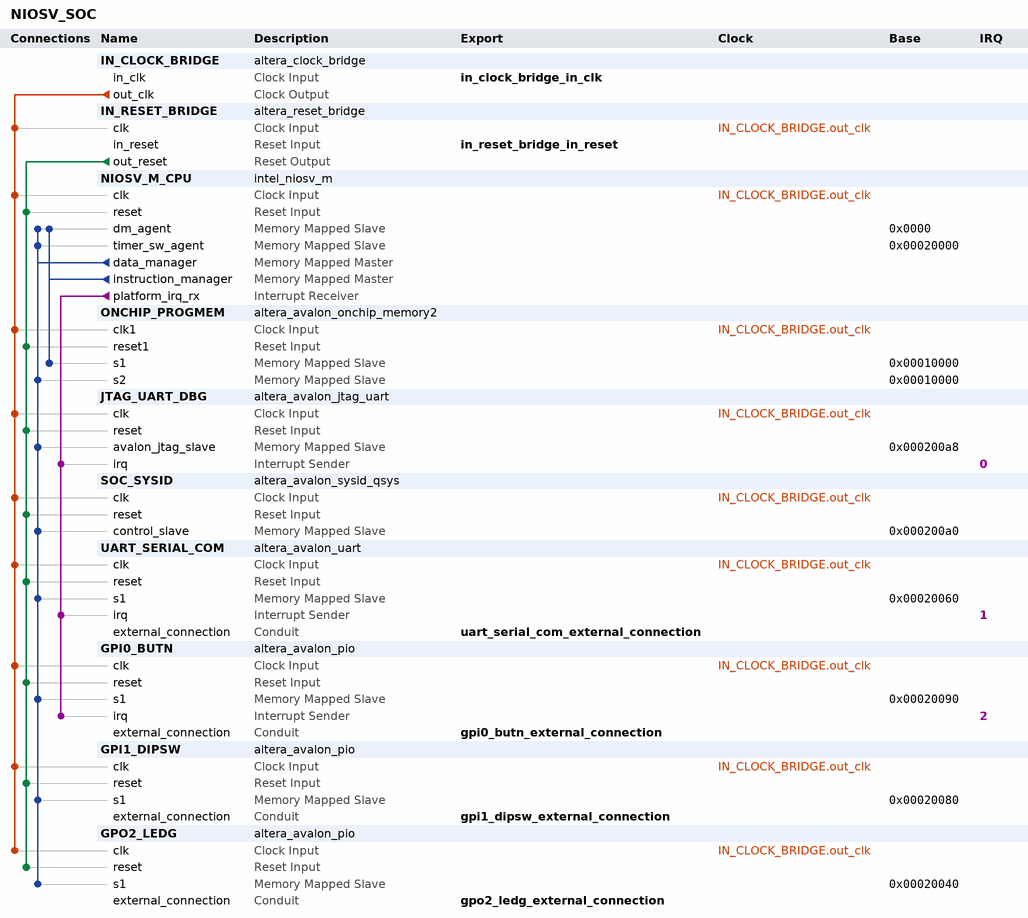
[diagram p0: system contents]
# Platform Designer (Qsys) system NIOSV_SOC, Cyclone IV E EP4CE22F17C6
# Parameters at their usual value, and those the tool derives, are not listed.
package require -exact qsys 23.1
create_system NIOSV_SOC
set_project_property DEVICE_FAMILY {Cyclone IV E}
set_project_property DEVICE EP4CE22F17C6

add_instance IN_CLOCK_BRIDGE altera_clock_bridge 23.1
set_instance_parameter_value IN_CLOCK_BRIDGE DERIVED_CLOCK_RATE 0
set_instance_parameter_value IN_CLOCK_BRIDGE EXPLICIT_CLOCK_RATE 100000000

add_instance IN_RESET_BRIDGE altera_reset_bridge 23.1
set_instance_parameter_value IN_RESET_BRIDGE ACTIVE_LOW_RESET 1
set_instance_parameter_value IN_RESET_BRIDGE SYNCHRONOUS_EDGES deassert

add_instance NIOSV_M_CPU intel_niosv_m 2.0.0
set_instance_parameter_value NIOSV_M_CPU clockFrequency 100000000
set_instance_parameter_value NIOSV_M_CPU enableDebugReset false
set_instance_parameter_value NIOSV_M_CPU enableECCLite true
set_instance_parameter_value NIOSV_M_CPU pipelineArch true
set_instance_parameter_value NIOSV_M_CPU resetSlave ONCHIP_PROGMEM.s1

add_instance ONCHIP_PROGMEM altera_avalon_onchip_memory2 23.1
set_instance_parameter_value ONCHIP_PROGMEM dataWidth 32
set_instance_parameter_value ONCHIP_PROGMEM dualPort true
set_instance_parameter_value ONCHIP_PROGMEM initMemContent true
set_instance_parameter_value ONCHIP_PROGMEM initializationFileName onchip_mem.hex
set_instance_parameter_value ONCHIP_PROGMEM memorySize 49152
set_instance_parameter_value ONCHIP_PROGMEM singleClockOperation true

add_instance JTAG_UART_DBG altera_avalon_jtag_uart 23.1
set_instance_parameter_value JTAG_UART_DBG simInteractiveOptions NO_INTERACTIVE_WINDOWS

add_instance SOC_SYSID altera_avalon_sysid_qsys 23.1
set_instance_parameter_value SOC_SYSID id -559038737

add_instance UART_SERIAL_COM altera_avalon_uart 23.1
set_instance_parameter_value UART_SERIAL_COM baud 115200
set_instance_parameter_value UART_SERIAL_COM dataBits 8
set_instance_parameter_value UART_SERIAL_COM fixedBaud true
set_instance_parameter_value UART_SERIAL_COM parity NONE
set_instance_parameter_value UART_SERIAL_COM stopBits 1

add_instance GPI0_BUTN altera_avalon_pio 23.1
set_instance_parameter_value GPI0_BUTN bitClearingEdgeCapReg true
set_instance_parameter_value GPI0_BUTN captureEdge true
set_instance_parameter_value GPI0_BUTN direction Input
set_instance_parameter_value GPI0_BUTN edgeType FALLING
set_instance_parameter_value GPI0_BUTN generateIRQ true
set_instance_parameter_value GPI0_BUTN irqType EDGE
set_instance_parameter_value GPI0_BUTN width 1

add_instance GPI1_DIPSW altera_avalon_pio 23.1
set_instance_parameter_value GPI1_DIPSW bitClearingEdgeCapReg true
set_instance_parameter_value GPI1_DIPSW captureEdge true
set_instance_parameter_value GPI1_DIPSW direction Input
set_instance_parameter_value GPI1_DIPSW edgeType ANY
set_instance_parameter_value GPI1_DIPSW width 4

add_instance GPO2_LEDG altera_avalon_pio 23.1
set_instance_parameter_value GPO2_LEDG bitModifyingOutReg true
set_instance_parameter_value GPO2_LEDG direction Output
set_instance_parameter_value GPO2_LEDG width 8

# connections
add_connection IN_CLOCK_BRIDGE.out_clk GPI0_BUTN.clk clock
add_connection IN_CLOCK_BRIDGE.out_clk GPI1_DIPSW.clk clock
add_connection IN_CLOCK_BRIDGE.out_clk GPO2_LEDG.clk clock
add_connection IN_CLOCK_BRIDGE.out_clk IN_RESET_BRIDGE.clk clock
add_connection IN_CLOCK_BRIDGE.out_clk JTAG_UART_DBG.clk clock
add_connection IN_CLOCK_BRIDGE.out_clk NIOSV_M_CPU.clk clock
add_connection IN_CLOCK_BRIDGE.out_clk ONCHIP_PROGMEM.clk1 clock
add_connection IN_CLOCK_BRIDGE.out_clk SOC_SYSID.clk clock
add_connection IN_CLOCK_BRIDGE.out_clk UART_SERIAL_COM.clk clock
add_connection IN_RESET_BRIDGE.out_reset GPI0_BUTN.reset reset
add_connection IN_RESET_BRIDGE.out_reset GPI1_DIPSW.reset reset
add_connection IN_RESET_BRIDGE.out_reset GPO2_LEDG.reset reset
add_connection IN_RESET_BRIDGE.out_reset JTAG_UART_DBG.reset reset
add_connection IN_RESET_BRIDGE.out_reset NIOSV_M_CPU.reset reset
add_connection IN_RESET_BRIDGE.out_reset ONCHIP_PROGMEM.reset1 reset
add_connection IN_RESET_BRIDGE.out_reset SOC_SYSID.reset reset
add_connection IN_RESET_BRIDGE.out_reset UART_SERIAL_COM.reset reset
add_connection NIOSV_M_CPU.data_manager GPI0_BUTN.s1 avalon
set_connection_parameter_value NIOSV_M_CPU.data_manager/GPI0_BUTN.s1 baseAddress 0x00020090
add_connection NIOSV_M_CPU.data_manager GPI1_DIPSW.s1 avalon
set_connection_parameter_value NIOSV_M_CPU.data_manager/GPI1_DIPSW.s1 baseAddress 0x00020080
add_connection NIOSV_M_CPU.data_manager GPO2_LEDG.s1 avalon
set_connection_parameter_value NIOSV_M_CPU.data_manager/GPO2_LEDG.s1 baseAddress 0x00020040
add_connection NIOSV_M_CPU.data_manager JTAG_UART_DBG.avalon_jtag_slave avalon
set_connection_parameter_value NIOSV_M_CPU.data_manager/JTAG_UART_DBG.avalon_jtag_slave baseAddress 0x000200a8
add_connection NIOSV_M_CPU.data_manager NIOSV_M_CPU.dm_agent avalon
set_connection_parameter_value NIOSV_M_CPU.data_manager/NIOSV_M_CPU.dm_agent baseAddress 0x0000
add_connection NIOSV_M_CPU.data_manager NIOSV_M_CPU.timer_sw_agent avalon
set_connection_parameter_value NIOSV_M_CPU.data_manager/NIOSV_M_CPU.timer_sw_agent baseAddress 0x00020000
add_connection NIOSV_M_CPU.data_manager ONCHIP_PROGMEM.s2 avalon
set_connection_parameter_value NIOSV_M_CPU.data_manager/ONCHIP_PROGMEM.s2 baseAddress 0x00010000
add_connection NIOSV_M_CPU.data_manager SOC_SYSID.control_slave avalon
set_connection_parameter_value NIOSV_M_CPU.data_manager/SOC_SYSID.control_slave baseAddress 0x000200a0
add_connection NIOSV_M_CPU.data_manager UART_SERIAL_COM.s1 avalon
set_connection_parameter_value NIOSV_M_CPU.data_manager/UART_SERIAL_COM.s1 baseAddress 0x00020060
add_connection NIOSV_M_CPU.instruction_manager NIOSV_M_CPU.dm_agent avalon
set_connection_parameter_value NIOSV_M_CPU.instruction_manager/NIOSV_M_CPU.dm_agent baseAddress 0x0000
add_connection NIOSV_M_CPU.instruction_manager ONCHIP_PROGMEM.s1 avalon
set_connection_parameter_value NIOSV_M_CPU.instruction_manager/ONCHIP_PROGMEM.s1 baseAddress 0x00010000
add_connection NIOSV_M_CPU.platform_irq_rx GPI0_BUTN.irq interrupt
set_connection_parameter_value NIOSV_M_CPU.platform_irq_rx/GPI0_BUTN.irq irqNumber 2
add_connection NIOSV_M_CPU.platform_irq_rx JTAG_UART_DBG.irq interrupt
set_connection_parameter_value NIOSV_M_CPU.platform_irq_rx/JTAG_UART_DBG.irq irqNumber 0
add_connection NIOSV_M_CPU.platform_irq_rx UART_SERIAL_COM.irq interrupt
set_connection_parameter_value NIOSV_M_CPU.platform_irq_rx/UART_SERIAL_COM.irq irqNumber 1

# exported interfaces
add_interface gpi0_butn_external_connection conduit end
set_interface_property gpi0_butn_external_connection EXPORT_OF GPI0_BUTN.external_connection
add_interface gpi1_dipsw_external_connection conduit end
set_interface_property gpi1_dipsw_external_connection EXPORT_OF GPI1_DIPSW.external_connection
add_interface gpo2_ledg_external_connection conduit end
set_interface_property gpo2_ledg_external_connection EXPORT_OF GPO2_LEDG.external_connection
add_interface in_clock_bridge_in_clk clock sink
set_interface_property in_clock_bridge_in_clk EXPORT_OF IN_CLOCK_BRIDGE.in_clk
add_interface in_reset_bridge_in_reset reset sink
set_interface_property in_reset_bridge_in_reset EXPORT_OF IN_RESET_BRIDGE.in_reset
add_interface uart_serial_com_external_connection conduit end
set_interface_property uart_serial_com_external_connection EXPORT_OF UART_SERIAL_COM.external_connection

set_interconnect_requirement {$system} qsys_mm.clockCrossingAdapter HANDSHAKE
set_interconnect_requirement {$system} qsys_mm.enableEccProtection FALSE
set_interconnect_requirement {$system} qsys_mm.insertDefaultSlave FALSE
set_interconnect_requirement {$system} qsys_mm.maxAdditionalLatency 1

save_system NIOSV_SOC.qsys
